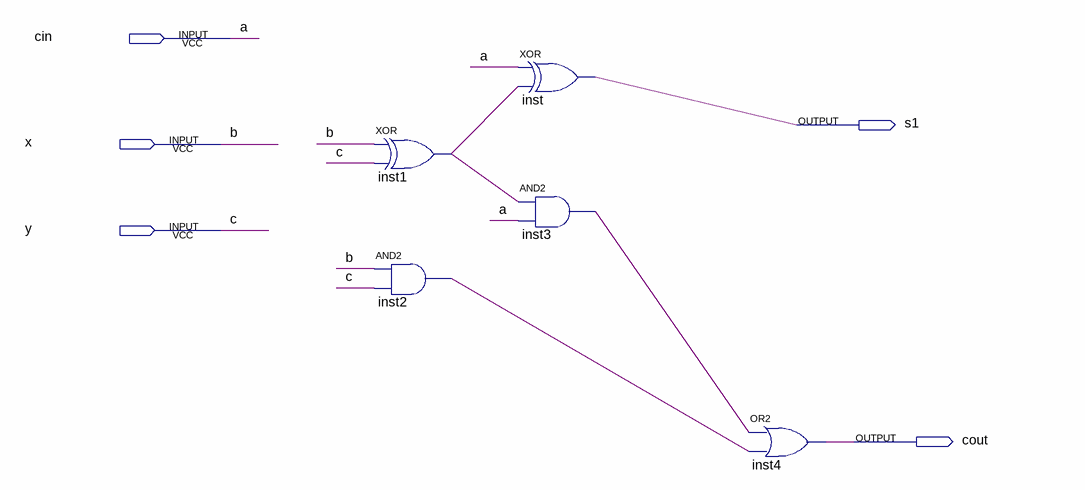
[diagram p0: schematic sheet]
// Quartus schematic aula05.bdf as structural Verilog: 5 symbols, 5 pins
module aula05 (
  input  cin,
  input  x,
  input  y,
  output s1,
  output cout
);

  wire inst1_out, inst2_out, inst3_out;

  xor inst1 (inst1_out, x, y);
  and inst2 (inst2_out, x, y);
  xor inst (s1, cin, inst1_out);
  and inst3 (inst3_out, inst1_out, cin);
  or inst4 (cout, inst3_out, inst2_out);

  // Other names for the same wires on the sheet: a = cin; b = x; c = y
endmodule
